# Altium schematic sheet BaseFunctions.SchDoc
size 297 x 209 mm; SheetNumber: 2; SheetTotal: 4; swcgroup: FabLabs; Org: Sainsbury Wellcome Centre; Add1: 25 Howland Street; Add2: London; Add3: W1T 4JG; WebAddress: www.sainsburywellcome.org; SheetSize: A4; SheetName: Base Functions
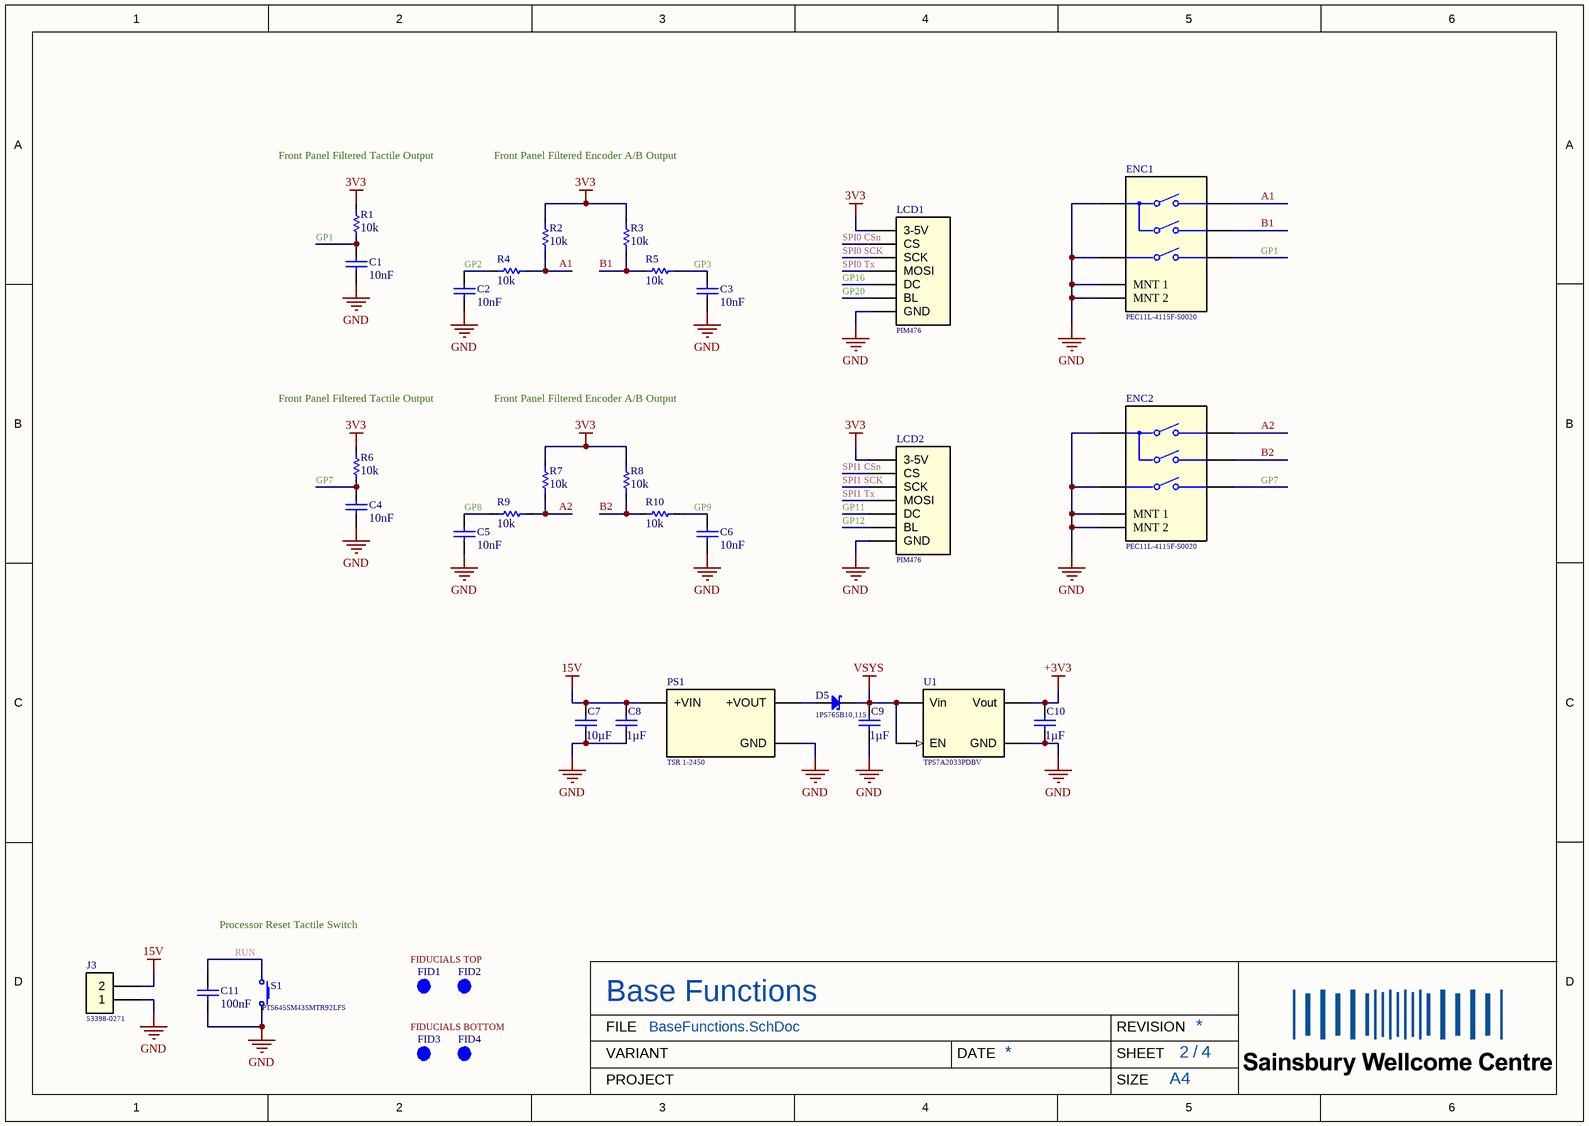
[diagram p0: BaseFunctions.SchDoc]

## Parts
C1  value 10nF  [CAPC1608X90X35NL15T15]  (hidden comment: C0603-10nF-100V-10%-X7R)
C2  value 10nF  [CAPC1608X90X35NL15T15]  (hidden comment: C0603-10nF-100V-10%-X7R)
C3  value 10nF  [CAPC1608X90X35NL15T15]  (hidden comment: C0603-10nF-100V-10%-X7R)
C4  value 10nF  [CAPC1608X90X35NL15T15]  (hidden comment: C0603-10nF-100V-10%-X7R)
C5  value 10nF  [CAPC1608X90X35NL15T15]  (hidden comment: C0603-10nF-100V-10%-X7R)
C6  value 10nF  [CAPC1608X90X35NL15T15]  (hidden comment: C0603-10nF-100V-10%-X7R)
C7  value 10µF  [CAPC3225X279X50NL20T25]  (hidden comment: C1210-10uF-50V-10%-X7R)
C8  value 1µF  [FP-GRM188-0_1-e0_2_0_5-IPC_B]  (hidden comment: C0603-1uF-25V-10%-X7R)
C9  value 1µF  [FP-GRM188-0_1-e0_2_0_5-IPC_B]  (hidden comment: C0603-1uF-25V-10%-X7R)
C10  value 1µF  [FP-GRM188-0_1-e0_2_0_5-IPC_B]  (hidden comment: C0603-1uF-25V-10%-X7R)
C11  value 100nF  [FP-GRM188-0_1-e0_2_0_5-IPC_B]  (hidden comment: C0603-100nF-100V-10%-X7R)
D5  1PS76SB10,115  [FP-SOD323F-MFG]
ENC1  PEC11L-4115F-S0020  [FP-PEC11L-4115F-S0020-MFG]
ENC2  PEC11L-4115F-S0020  [FP-PEC11L-4115F-S0020-MFG]
FID1  FID-ROUND  [Fid_Round]  (value not drawn)  (no BOM)
FID2  FID-ROUND  [Fid_Round]  (value not drawn)  (no BOM)
FID3  FID-ROUND  [Fid_Round]  (value not drawn)  (no BOM)
FID4  FID-ROUND  [Fid_Round]  (value not drawn)  (no BOM)
J3  53398-0271  [MOLX-53398-0271_V]
LCD1  PIM476  [LCD-PIM476-TSW - 2mm9 standoff]
LCD2  PIM476  [LCD-PIM476-TSW - 2mm9 standoff]
PS1  TSR 1-2450  [CONV_TSR_1-2433]
R1  value 10k  [FP-CPF0603-IPC_B]  (hidden comment: R0603-10k-1/16W-0.1%)
R2  value 10k  [FP-CPF0603-IPC_B]  (hidden comment: R0603-10k-1/16W-0.1%)
R3  value 10k  [FP-CPF0603-IPC_B]  (hidden comment: R0603-10k-1/16W-0.1%)
R4  value 10k  [FP-CPF0603-IPC_B]  (hidden comment: R0603-10k-1/16W-0.1%)
R5  value 10k  [FP-CPF0603-IPC_B]  (hidden comment: R0603-10k-1/16W-0.1%)
R6  value 10k  [FP-CPF0603-IPC_B]  (hidden comment: R0603-10k-1/16W-0.1%)
R7  value 10k  [FP-CPF0603-IPC_B]  (hidden comment: R0603-10k-1/16W-0.1%)
R8  value 10k  [FP-CPF0603-IPC_B]  (hidden comment: R0603-10k-1/16W-0.1%)
R9  value 10k  [FP-CPF0603-IPC_B]  (hidden comment: R0603-10k-1/16W-0.1%)
R10  value 10k  [FP-CPF0603-IPC_B]  (hidden comment: R0603-10k-1/16W-0.1%)
S1  PTS645SM43SMTR92LFS  [FP-PTS645SM43SMTR92LFS-MFG]
U1  TPS7A2033PDBV  [FP-DBV0005A-IPC_B]

## Nets
3V3: LCD1.1(3-5V) LCD2.1(3-5V) R1.2 R2.2 R3.2 R6.2 R7.2 R8.2
15V: C7.2 C8.2 J3.2 PS1.1(+VIN)
+3V3: C10.2 U1.5(Vout)
GND: C1.1 C2.1 C3.1 C4.1 C5.1 C6.1 C7.1 C8.1 C9.1 C10.1 C11.1 ENC1.1 ENC1.3(MNT_1) ENC1.4(MNT_2) ENC1.C(COMMON) ENC2.1 ENC2.3(MNT_1) ENC2.4(MNT_2) ENC2.C(COMMON) J3.1 LCD1.7(GND) LCD2.7(GND) PS1.2(GND) S1.1 U1.2(GND)
VSYS: C9.2 D5.1(C) U1.1(Vin) U1.3(EN)
A1: ENC1.A(CHANNEL_A) R2.1 R4.1
A2: ENC2.A(CHANNEL_A) R7.1 R9.1
B1: ENC1.B(CHANNEL_B) R3.1 R5.2
B2: ENC2.B(CHANNEL_B) R8.1 R10.2
GP1: C1.2 ENC1.2 R1.1
GP2: C2.2 R4.2
GP3: C3.2 R5.1
GP7: C4.2 ENC2.2 R6.1
GP8: C5.2 R9.2
GP9: C6.2 R10.1
GP11: LCD2.5(DC)
GP12: LCD2.6(BL)
GP16: LCD1.5(DC)
GP20: LCD1.6(BL)
RUN: C11.2 S1.2
SPI0 CSn: LCD1.2(CS)
SPI0 SCK: LCD1.3(SCK)
SPI0 Tx: LCD1.4(MOSI)
SPI1 CSn: LCD2.2(CS)
SPI1 SCK: LCD2.3(SCK)
SPI1 Tx: LCD2.4(MOSI)
NetD5_2: D5.2(A) PS1.3(+VOUT)

## Notes on the sheet
- (near R1) Front Panel Filtered Tactile Output
- Front Panel Filtered Encoder A/B Output
- (near R6) Front Panel Filtered Tactile Output
- Processor Reset Tactile Switch
- FIDUCIALS TOP
- FIDUCIALS BOTTOM
- FILE
- VARIANT
- DATE
- REVISION
- SHEET
- /
- PROJECT
- SIZE

## Library data of the parts
C1-C6 = CMP-611-0030-6: 0.01µF ±10% 100V Ceramic Capacitor X7R 0603 (1608 Metric); Case/Package: 0603; Length: 1.6mm; Case Code (Metric): 1608; Width: 0.032inch; Max Operating Temperature: 125°C; Min Operating Temperature: -55°C; RoHS Compliant: Yes; Series: FLEXITERM®; Radiation Hardening: No; Capacitance: 10nF; Voltage Rating (DC): 100V; Tolerance: 10%; Package Quantity: 1; Dielectric: X7R; Features: Soft Termination; Packaging: Tape and Reel; Lead Free: Lead Free; Depth: 0.81mm; Construction: Flat; Height: 0.94mm; Voltage Rating: 100V; Thickness: 0.037inch; Mount: Surface Mount; Case Code (Imperial): 0603; Termination: SMD/SMT; Capacitor Type: Ceramic; RoHS: Yes
C7 = CMP-611-0024-5: 10uF ±10% 50V Ceramic Capacitor X7R 1210 (3225 Metric); Pick&PlaceFootprint: C1210; Voltage Rating: 50V; Case/Package: 1210; Capacitor Type: Ceramic; Mount: Surface Mount; Tolerance: 10%; Dielectric: X7R; Capacitance: 10uF; RoHS: Yes
C8-C10 = CMP-611-0033-6: 1µF ±10% 25V Ceramic Capacitor X7R 0603 (1608 Metric); Capacitance: 1uF; Pick&PlaceFootprint: 0603_CAP; Width: 0.8mm; Size: 0.8mm; Case/Package: 0603; RoHS: Yes; Voltage Rating: 25V; Weight: 0.000222oz; Radiation Hardening: No; Series: GRM; Mount: Surface Mount; Material: Ceramic; Case Code (Metric): 1608; Thickness: 0.035inch; Max Operating Temperature: 125°C; Termination: Wraparound; Case Code (Imperial): 0603; Package Quantity: 1; Tolerance: 10%; Construction: Flat; REACH SVHC: Yes; Voltage: 25V; Height: 0.9mm; Capacitor Type: Ceramic; Min Operating Temperature: -55°C; Length: 1.6mm; Dielectric: X7R; Lead Free: Lead Free; RoHS Compliant: Yes; Depth: 0.8mm; Voltage Rating (DC): 25V; Packaging: Tape and Reel
C11 = CMP-611-0027-19: 0.1µF ±10% 100V Ceramic Capacitor X7R 0603 (1608 Metric); Pick&PlaceFootprint: 0603_CAP; Mount: Surface Mount; Voltage Rating: 100V; Min Operating Temperature: -55°C; Termination: SMD/SMT; Width: 0.8mm; Series: GRM; Packaging: Tape and Reel; Size: 0.8mm; Case Code (Metric): 1608; REACH SVHC: No SVHC; Case/Package: 0603; Construction: Flat; Dielectric: X7R; Weight: 0.000222oz; Height: 0.8mm; Tolerance: 10%; Package Quantity: 1; Lead Free: Lead Free; Voltage: 100V; RoHS Compliant: Yes; Capacitance: 100nF; Thickness: 0.035inch; Radiation Hardening: No; Depth: 0.8mm; Length: 1.6mm; Max Operating Temperature: 125°C; Material: Ceramic; Case Code (Imperial): 0603; Voltage Rating (DC): 100V; Capacitor Type: Ceramic; RoHS: Yes
D5 = CMP-821-0008-2: Rectifier Diode, Schottky, 1 Phase, 1 Element, 0.2A, Silicon; Package Body Material: Plastic; Qualification Status: Not Qualified; Number of Elements: 1; Time @ Peak Reflow Temperature-Max (s): 40s; Max Output current: 200mA; Terminal Finish: Tin; Technology: SCHOTTKY; Pins: 2; JESD-609 Code: e3; Reach SVHC Compliant: Yes; Package Style: SMALL OUTLINEMeter; PartNumber: 1PS76SB10,115; Terminal Form: Gull Wing; Mount: Surface Mount; Surface Mount: Yes; RoHS Compliant: Yes; Max Operating Temperature: 125°C; Moisture Sensitivity Level: 1; Diode Type: RECTIFIER; Diode Element Material: SILICON; JESD-30 Code: R-PDSO-G2; Package Shape: Rectangular; Peak Reflow Temperature (Cel): 260°C; Terminal Position: DUAL
ENC1 ENC2 = CMP-B00-0003-3: LOW PROFILE ENCODER, 11 MM, CONTACT RATING 10 MA - 5 VDC; Pulses per Revolution: 20; Number of Channels: 2; Encoder Type: Mechanical; Built in Switch: Yes; Output Type: Quadrature,Incremental; Termination: PC Pin; Width: 11.8mm; Max Operating Temperature: 80°C; Orientation: Vertical; Packaging: Bulk; Series: PEC11; Package Quantity: 75; Mount: Through Hole,Panel,PCB; Length: 19.5mm; Detent: Yes; Height: 12mm; RoHS Compliant: Yes; Min Operating Temperature: -25°C
FID1-FID4 = CMP-C00-0001-2: Round Fiducial
J3 = CMP-370-0034-4: Board Connector, 2 Contact(s), 1 Row(s), Male, Straight, 0.049 inch Pitch, Surface Mount Terminal, Locking, Natural Insulator, Receptacle; Mixed Contacts: No; Board Mounting Option: FITTING NAIL; Insulation Resistance: 100MR; Mating Information: MULTIPLE MATING PARTS AVAILABLE; PCB Contact Pattern: RECTANGULAR; Plating Thickness: 39uin; Number Of PCB Rows: 1; Reliability: COMMERCIAL; Polarization Key: POLARIZED HOUSING; Number of Contacts: 2; Rated Current (Signal): 1A; Body Length: 0.285inch; Durability: 30Cycles; Contact Resistance: 20mR; Body Breadth: 0.165inch; Reference Standard: UL; Contact Style: Blade Pin; Option: General Purpose; Dielectric Withstanding Voltage (AC): 250V; Body Depth: 0.185inch; Contact Material: Bronze; Insulation Material: Polyamide; PartNumber: 53398-0271; Max Operating Temperature: 85°C; RoHS Compliant: Yes; Contact Gender: Male; Min Operating Temperature: -40°C; IEC Conformance: No; Termination: SMD/SMT; Mating Contact Pitch: 0.049inch; REACH SVHC: Yes; Insulation Color: Natural; Mount: Board; DIN Conformance: No; Number Of Connectors: 1; Terminal Pitch: 1.25mm; Mounting Option 1: LOCKING; Number of Rows Loaded: 1; Flammability Rating: UL94 V-0; Body/Shell Style: RECEPTACLE; Contact Pattern: RECTANGULAR; Mounting Style: STRAIGHT; Filter Feature: No; Contact Finish - Termination: Tin (Sn); Contact Finish - Mating: MATTE TIN (39) OVER NICKEL; Connector Type: BOARD CONNECTOR; MIL Conformance: No; JESD-609 Code: e3
LCD1 LCD2 = CMP-A00-0000-5: 1.3" Spi Colour Lcd (240X240) Breakout; Pick&PlaceFootprint: NA; PartNumber: PIM476
PS1 = CMP-A10-0008-4: DC/DC Converter, ITE, 1 Output, 5 W, 5 V, 1 A, TSR 1 Series; PartNumber: TSR 1-2450
R1-R10 = CMP-633-0002-15: Surface Mount Resistor 10k Ohm 1/16 W 0.1% 0603 (1608 Metric); Pick&PlaceFootprint: R0603; Power Rating: 62.5mW; Voltage Rating (DC): 50V; Number of Resistors: 1; Temperature Coefficient: 25ppm/°C; Max Power Dissipation: 62.5 mW; Height: 0.45mm; Case Code (Imperial): 0603; RoHS: Yes; Composition: Thin Film; Number of Terminations: 2; Case/Package: 0603; Min Operating Temperature: -55°C; ELV: Compliant; Mount: Surface Mount; Packaging: Tape and Reel; Max Operating Temperature: 155°C; Tolerance: 0.1%; Case Code (Metric): 1608; Resistance: 10k; REACH SVHC: No SVHC; Width: 0.8mm; Number of Pins: 2; Voltage Rating: 50V; Length: 1.6mm; Termination: Solder; Weight: 7.1E-05oz; RoHS Compliant: Yes; Size Code: 0603; Series: CPF; Resistance Tolerance: 0.1%; Technology: Thin Film; Resistor Type: Thin Film
S1 = CMP-B00-0009-1: Keypad Switch, 1 Switches, SPST, Momentary-tactile, 0.05A, 12VDC, 1.57N, 4 PCB Hole Cnt, Solder Terminal, Surface Mount-straight; pin to pad: 1>1+2 2>3+4; Case/Package: PT645; Mount: Surface Mount; PartNumber: PTS645SM43SMTR92LFS
U1 = CMP-970-0027-1: Fixed Positive LDO Regulator, 3.3V, 0.14V Dropout, PDSO5; Pick&PlaceFootprint: SOT-23; PartNumber: TPS7A2033PDBV